# EAGLE design XPDR_Board_1 (EAGLE 7.2.0)
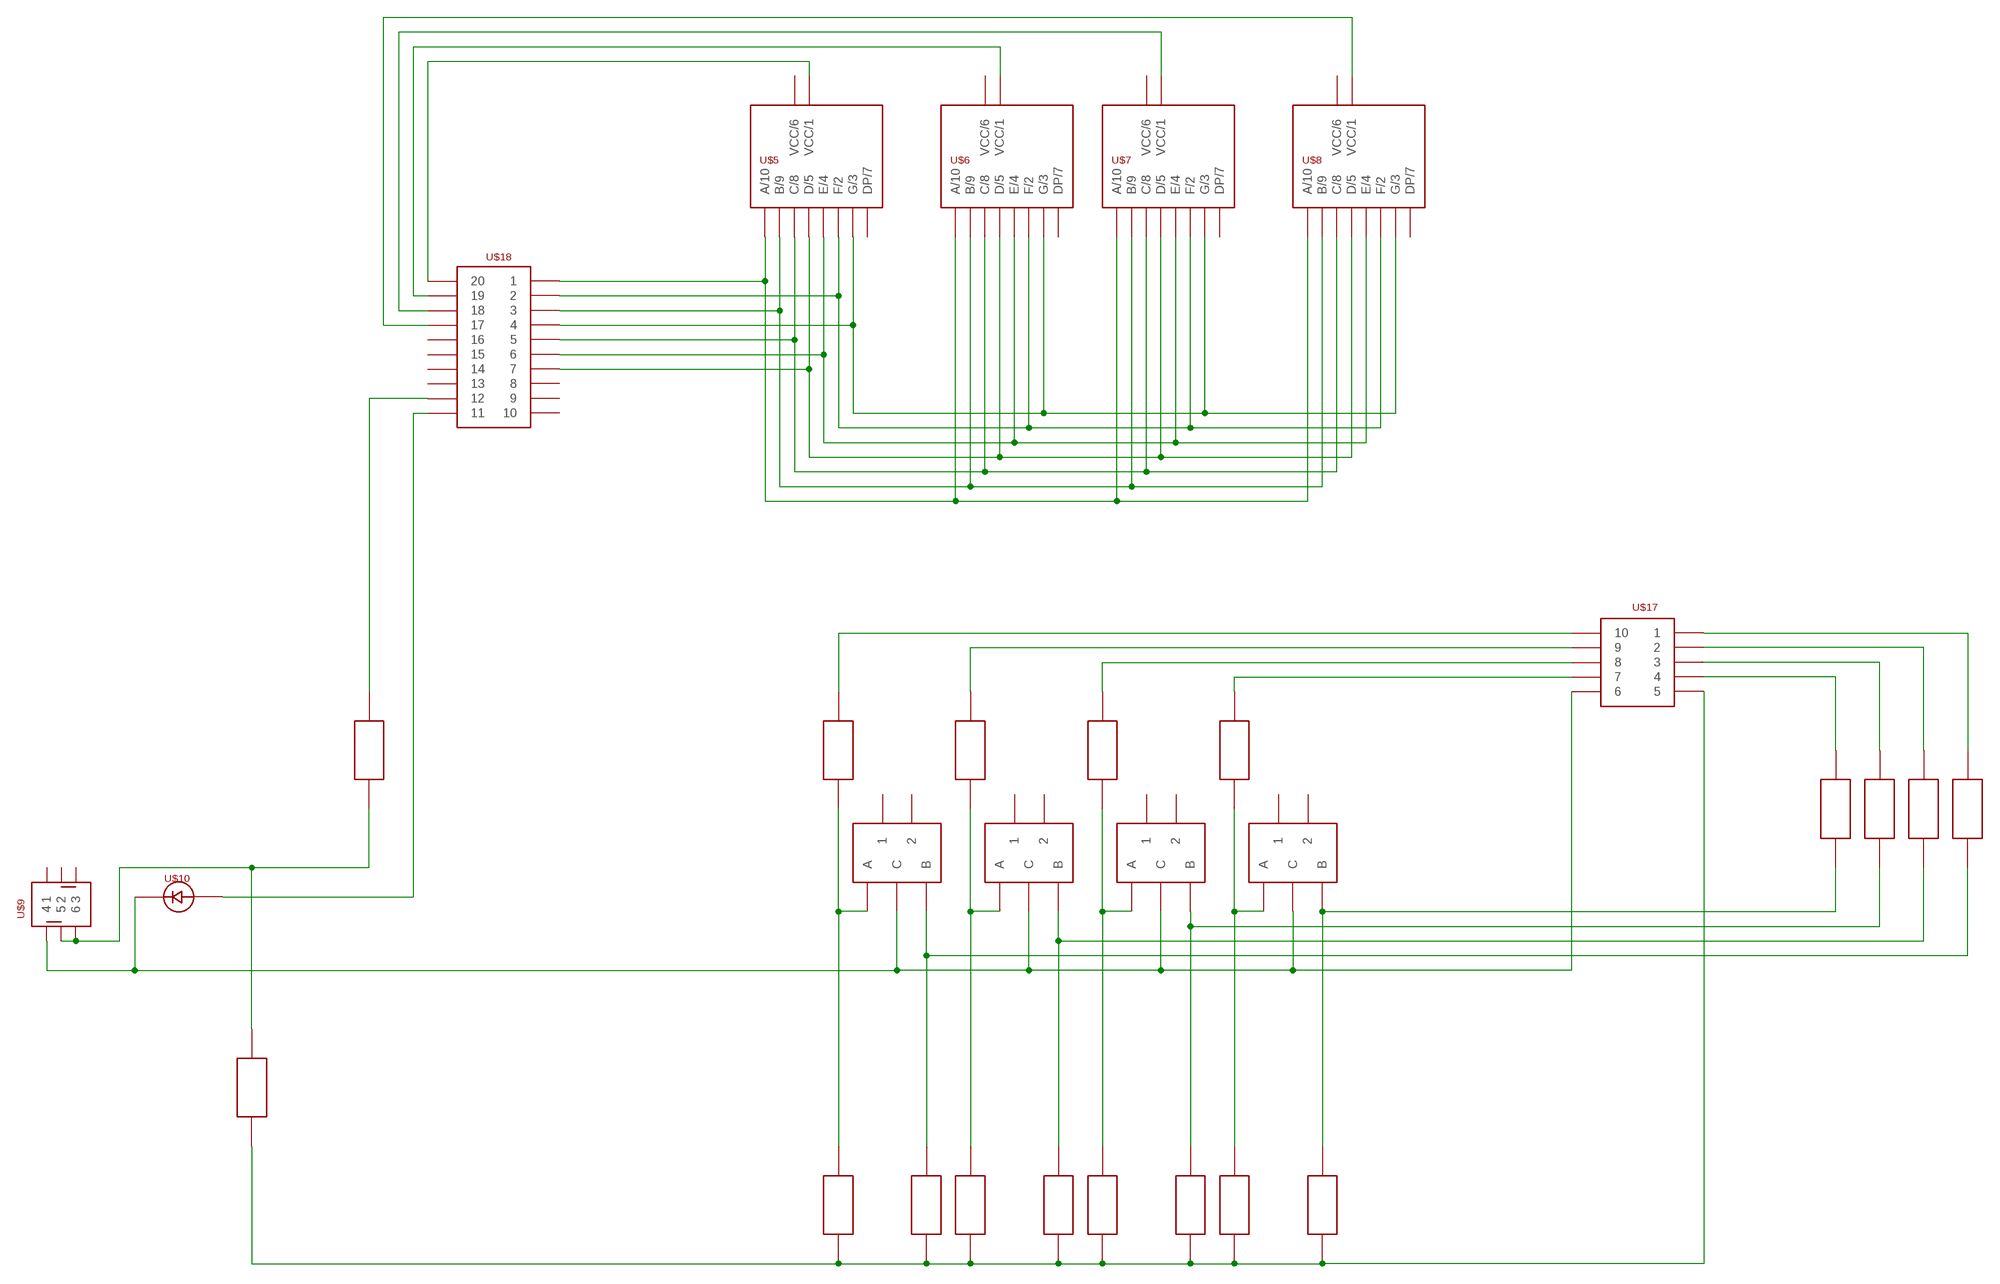
[diagram p0: schematic, sheet 1]

## Parts
U$1  PEC11R  [PEC11R]
U$2  PEC11R  [PEC11R]
U$3  PEC11R  [PEC11R]
U$4  PEC11R  [PEC11R]
U$5  SA3611EWA  [SA3611EWA]
U$6  SA3611EWA  [SA3611EWA]
U$7  SA3611EWA  [SA3611EWA]
U$8  SA3611EWA  [SA3611EWA]
U$9  P1-0S  [P1-0S]
U$10  LED_5MM  [LED_5MM]
U$11  REZISTOR  [REZISTOR]
U$12  REZISTOR  [REZISTOR]
U$13  REZISTOR  [REZISTOR]
U$14  REZISTOR  [REZISTOR]
U$15  REZISTOR  [REZISTOR]
U$16  REZISTOR  [REZISTOR]
U$17  LISTA_2X5  [LISTA_2X5]
U$18  LISTA_2X10  [LISTA_2X10]
U$19  REZISTOR  [REZISTOR]
U$20  REZISTOR  [REZISTOR]
U$21  REZISTOR  [REZISTOR]
U$22  REZISTOR  [REZISTOR]
U$23  REZISTOR  [REZISTOR]
U$24  REZISTOR  [REZISTOR]
U$25  REZISTOR  [REZISTOR]
U$26  REZISTOR  [REZISTOR]
U$27  REZISTOR  [REZISTOR]
U$28  REZISTOR  [REZISTOR]
U$30  REZISTOR  [REZISTOR]
U$31  REZISTOR  [REZISTOR]

## Nets
N$1: U$5.10(A/10) U$6.10(A/10) U$7.10(A/10) U$8.10(A/10) U$18.1
N$2: U$5.9(B/9) U$6.9(B/9) U$7.9(B/9) U$8.9(B/9) U$18.3
N$3: U$5.8(C/8) U$6.8(C/8) U$7.8(C/8) U$8.8(C/8) U$18.5
N$4: U$5.5(D/5) U$6.5(D/5) U$7.5(D/5) U$8.5(D/5) U$18.7
N$5: U$11.P$2 U$17.10
N$6: U$5.2(F/2) U$6.2(F/2) U$7.2(F/2) U$8.2(F/2) U$18.2
N$7: U$5.3(G/3) U$6.3(G/3) U$7.3(G/3) U$8.3(G/3) U$18.4
N$8: U$1.B U$12.P$1 U$27.P$1
N$9: U$5.4(E/4) U$6.4(E/4) U$7.4(E/4) U$8.4(E/4) U$18.6
N$10: U$13.P$2 U$17.9
N$11: U$2.B U$14.P$1 U$25.P$1
N$12: U$15.P$2 U$17.8
N$13: U$3.B U$16.P$1 U$23.P$1
N$14: U$17.7 U$19.P$2
N$15: U$4.B U$20.P$1 U$21.P$1
N$16: U$5.1(VCC/1) U$18.20
N$17: U$6.1(VCC/1) U$18.19
N$18: U$7.1(VCC/1) U$18.18
N$19: U$8.1(VCC/1) U$18.17
N$20: U$9.5 U$9.6 U$30.P$2 U$31.P$1
N$21: U$1.C U$2.C U$3.C U$4.C U$9.4 U$10.P$2 U$17.6
N$22: U$1.A U$11.P$1 U$28.P$1
N$23: U$12.P$2 U$17.1
N$24: U$17.5 U$21.P$2 U$22.P$2 U$23.P$2 U$24.P$2 U$25.P$2 U$26.P$2 U$27.P$2 U$28.P$2 U$31.P$2
N$25: U$3.A U$15.P$1 U$24.P$1
N$26: U$10.P$1 U$18.11
N$27: U$4.A U$19.P$1 U$22.P$1
N$28: U$14.P$2 U$17.2
N$29: U$16.P$2 U$17.3
N$30: U$17.4 U$20.P$2
N$31: U$2.A U$13.P$1 U$26.P$1
N$33: U$18.12 U$30.P$1
Unconnected: U$1.1 U$1.2 U$2.1 U$2.2 U$3.1 U$3.2 U$4.1 U$4.2 U$5.6(VCC/6) U$5.7(DP/7) U$6.6(VCC/6) U$6.7(DP/7) U$7.6(VCC/6) U$7.7(DP/7) U$8.6(VCC/6) U$8.7(DP/7) U$9.1 U$9.2 U$9.3 U$18.8 U$18.9 U$18.10 U$18.13 U$18.14 U$18.15 U$18.16

## Library data of the parts
U$1-U$4 = RadioStack_v2:PEC11R
U$5-U$8 = RadioStack_v2:SA3611EWA
U$9 = RadioStack_v2:P1-0S
U$10 = RadioStack_v2:LED_5MM
U$11-U$16 U$19-U$28 U$30 U$31 = RadioStack_v2:REZISTOR
U$17 = RadioStack_v2:LISTA_2X5
U$18 = RadioStack_v2:LISTA_2X10

## Board
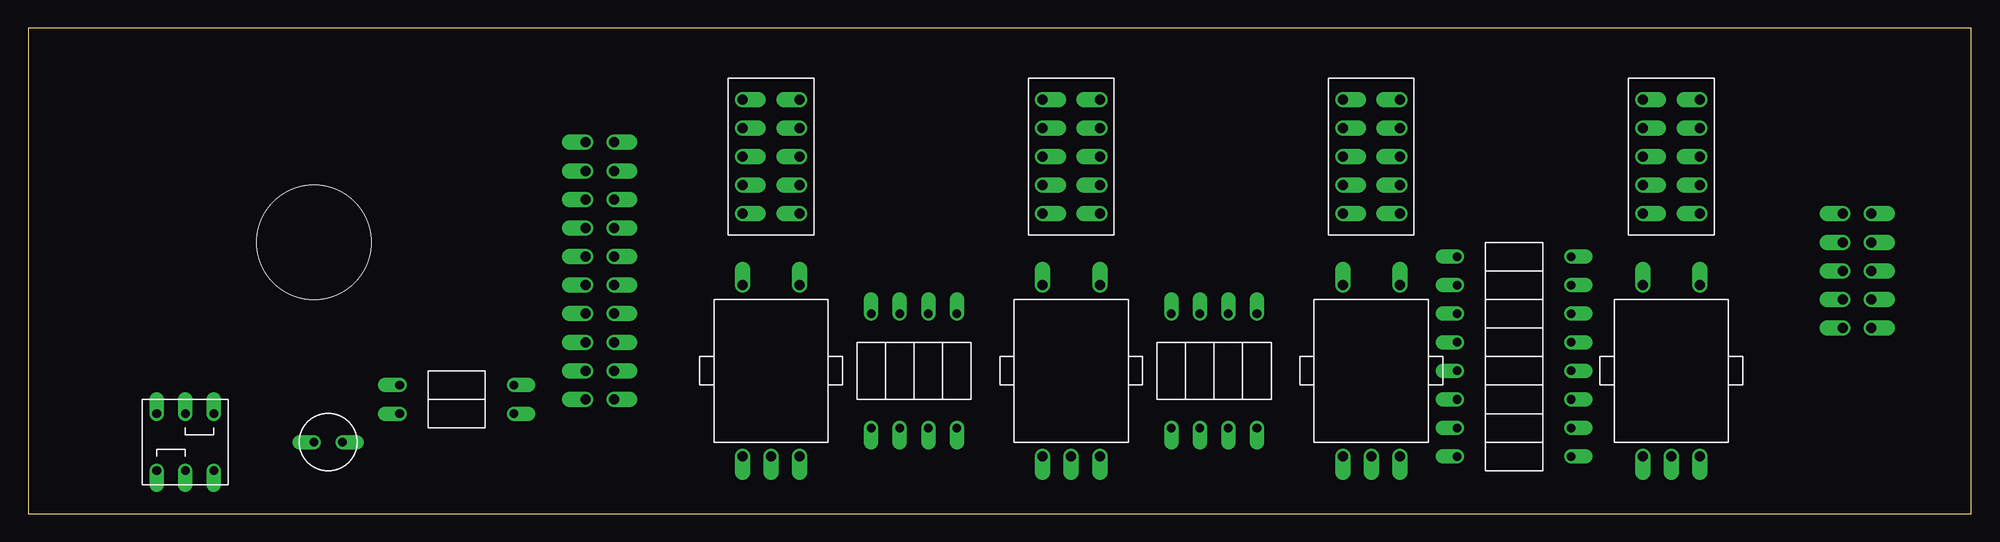
[diagram p1: board, top side]
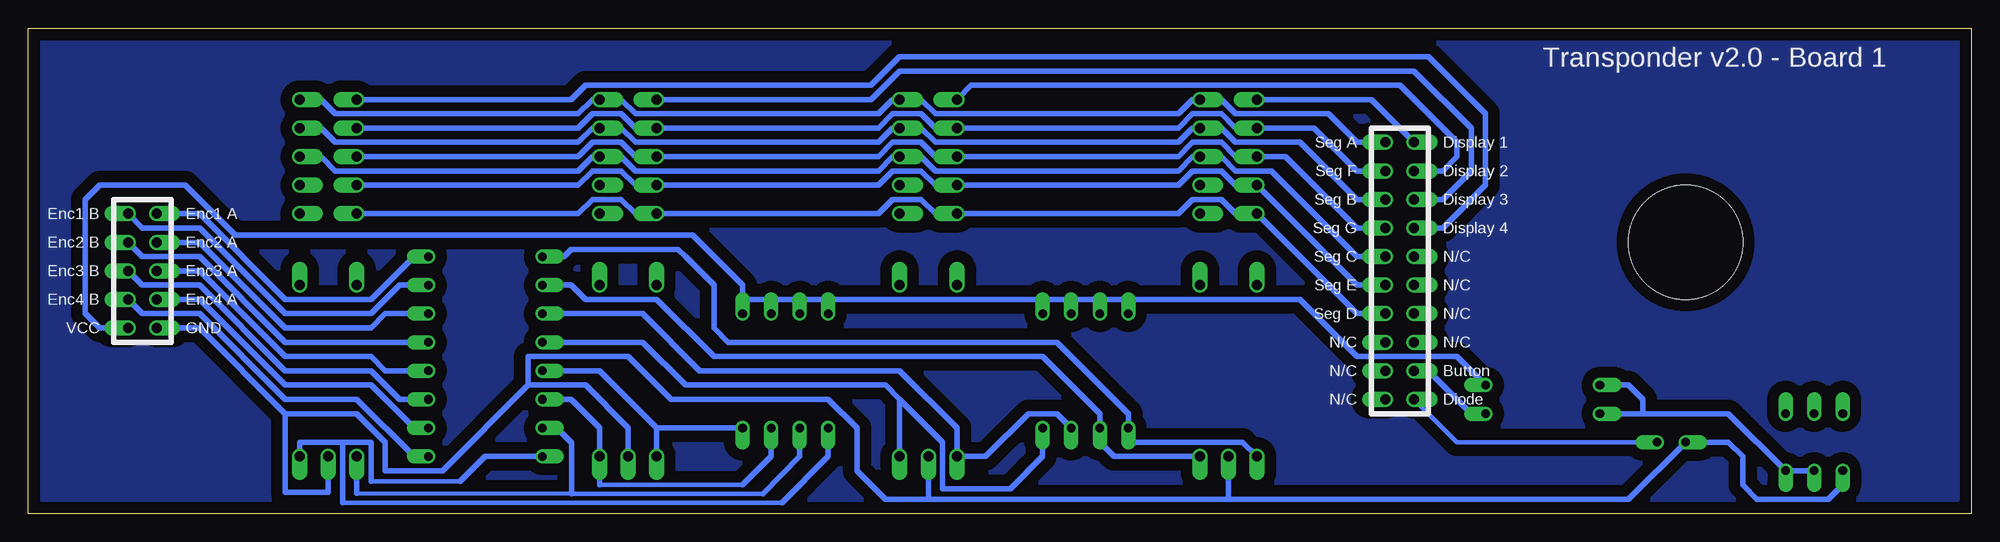
[diagram p2: board, bottom side, seen from below]

Size 172.72 x 43.18 mm. Coordinates in mm from the lower left corner, seen from the top.
Outline: 0,43.18 0,0 172.72,0 172.72,43.18 0,43.18
Copper layers (1*16): Top 0.035mm / dielectric 1.5mm / Bottom 0.035mm
Design rules "RadioStack_v2": minimum track width 0.2mm, minimum drill 0.4mm, track to track 0.2mm, track to pad 0.2mm, pad to pad 0.2mm, via to via 0.2mm, smd to smd 0.2mm, copper to edge 0.5mm, drill to drill 8mil, minimum pad ring 10mil, minimum via ring 8mil, stop-mask expansion 4mil, vias tented up to drill 0mil, thermal gap 10mil
Holes 10.16 mm at 25.4,24.13

### Footprints (pad centres in the part's own frame; a part is rotated, then mirrored left to right if it is on the bottom)
PEC11R = drill 0.889 pad 1.27 offset: 1 0,15.24; 2 5.08,15.24; A 0,0; B 5.08,0; C 2.54,0
SA3611EWA = drill 0.889 pad 1.27 offset: 1 0,0; 2 0,-2.54; 3 0,-5.08; 4 0,-7.62; 5 0,-10.16; 6 5.08,-10.16; 7 5.08,-7.62; 8 5.08,-5.08; 9 5.08,-2.54; 10 5.08,0
P1-0S = drill 0.762 pad 1.27 offset: 1 0,0; 2 2.54,0; 3 5.08,0; 4 0,-5.08; 5 2.54,-5.08; 6 5.08,-5.08
LED_5MM = drill 0.762 pad 1.27 offset: P$1 2.54,0; P$2 0,0
REZISTOR = drill 0.762 pad 1.27 offset: P$1 -5.08,0; P$2 5.08,0
LISTA_2X5 = drill 0.889 pad 1.27 offset: 1 0,0; 2 0,-2.54; 3 0,-5.08; 4 0,-7.62; 5 0,-10.16; 6 2.54,-10.16; 7 2.54,-7.62; 8 2.54,-5.08; 9 2.54,-2.54; 10 2.54,0
LISTA_2X10 = drill 0.889 pad 1.27 offset: 1 0,0; 2 0,-2.54; 3 0,-5.08; 4 0,-7.62; 5 0,-10.16; 6 0,-12.7; 7 0,-15.24; 8 0,-17.78; 9 0,-20.32; 10 0,-22.86; 11 2.54,-22.86; 12 2.54,-20.32; 13 2.54,-17.78; 14 2.54,-15.24; 15 2.54,-12.7; 16 2.54,-10.16; 17 2.54,-7.62; 18 2.54,-5.08; 19 2.54,-2.54; 20 2.54,0

### Placement (x,y rotation side)
U$1  63.5,5.08 0 top
U$2  90.17,5.08 0 top
U$3  116.84,5.08 0 top
U$4  143.51,5.08 0 top
U$5  63.5,36.83 0 top
U$6  90.17,36.83 0 top
U$7  116.84,36.83 0 top
U$8  143.51,36.83 0 top
U$9  11.43,8.89 0 top
U$10  25.4,6.35 0 top
U$11  132.08,22.86 0 top
U$12  132.08,20.32 0 top
U$13  132.08,17.78 0 top
U$14  132.08,15.24 0 top
U$15  132.08,12.7 0 top
U$16  132.08,10.16 0 top
U$17  163.83,26.67 0 bottom
U$18  52.07,33.02 0 bottom
U$19  132.08,7.62 0 top
U$20  132.08,5.08 0 top
U$21  101.6,12.7 90 top
U$22  104.14,12.7 90 top
U$23  106.68,12.7 90 top
U$24  109.22,12.7 90 top
U$25  82.55,12.7 90 top
U$26  80.01,12.7 90 top
U$27  77.47,12.7 90 top
U$28  74.93,12.7 90 top
U$30  38.1,8.89 180 top
U$31  38.1,11.43 0 top

### Tracks (layer width: path | path; a pad name or v marks a point on that pad's centre or on a via)
N$1
  Bottom 0.508: U$8.10 146.69,36.83 145.41,35.56 123.83,35.56 122.56,36.83 U$7.10 120.02,36.83 118.75,35.56 97.16,35.56 95.89,36.83 U$6.10 93.34,36.83 92.08,35.56 70.48,35.56 69.22,36.83 U$5.10 66.67,36.83 65.41,35.56 57.15,35.56 54.61,33.02 U$18.1
N$2
  Bottom 0.508: U$8.9 146.69,34.29 145.41,33.02 123.83,33.02 122.56,34.29 U$7.9 120.02,34.29 118.75,33.02 97.16,33.02 95.89,34.29 U$6.9 93.34,34.29 92.08,33.02 70.48,33.02 69.22,34.29 U$5.9 66.67,34.29 65.41,33.02 59.69,33.02 54.61,27.94 U$18.3
N$3
  Bottom 0.508: U$8.8 146.69,31.75 145.41,30.48 123.83,30.48 122.56,31.75 U$7.8 120.02,31.75 118.75,30.48 97.16,30.48 95.89,31.75 U$6.8 93.34,31.75 92.08,30.48 70.48,30.48 69.22,31.75 U$5.8 66.67,31.75 65.41,30.48 62.23,30.48 54.61,22.86 U$18.5
N$4
  Bottom 0.508: U$8.5 123.83,26.67 122.56,27.94 120.02,27.94 118.75,26.67 U$7.5 97.16,26.67 95.89,27.94 93.34,27.94 92.08,26.67 U$6.5 70.48,26.67 69.22,27.94 66.67,27.94 65.41,26.67 U$5.5 54.61,17.78 U$18.7
N$5
  Bottom 0.508: U$17.10 157.48,26.67 149.86,19.05 142.24,19.05 138.43,22.86 U$11.P$2
N$6
  Bottom 0.508: U$8.2 123.83,34.29 122.56,35.56 120.02,35.56 118.75,34.29 U$7.2 97.16,34.29 95.89,35.56 93.34,35.56 92.08,34.29 U$6.2 70.48,34.29 69.22,35.56 66.67,35.56 65.41,34.29 U$5.2 58.42,34.29 54.61,30.48 U$18.2
N$7
  Bottom 0.508: U$8.3 123.83,31.75 122.56,33.02 120.02,33.02 118.75,31.75 U$7.3 97.16,31.75 95.89,33.02 93.34,33.02 92.08,31.75 U$6.3 70.48,31.75 69.22,33.02 66.67,33.02 65.41,31.75 U$5.3 60.96,31.75 54.61,25.4 U$18.4
N$8
  Bottom 0.508: U$12.P$1 124.46,20.32 123.19,19.05 116.84,19.05 111.76,13.97 82.55,13.97 77.47,8.89 U$27.P$1 77.47,6.35 76.2,5.08 U$1.B
N$9
  Bottom 0.508: U$8.4 123.83,29.21 122.56,30.48 120.02,30.48 118.75,29.21 U$7.4 97.16,29.21 95.89,30.48 93.34,30.48 92.08,29.21 U$6.4 70.48,29.21 69.22,30.48 66.67,30.48 65.41,29.21 U$5.4 54.61,20.32 U$18.6
N$10
  Bottom 0.508: U$17.9 157.48,24.13 149.86,16.51 142.24,16.51 140.97,17.78 U$13.P$2
N$11
  Bottom 0.508: U$14.P$1 118.11,15.24 114.3,11.43 96.52,11.43 95.25,10.16 | U$25.P$1 82.55,5.08 85.41,2.22 91.44,2.22 91.44,6.35 95.25,10.16 | U$2.B 95.25,10.16
N$12
  Bottom 0.508: U$17.8 157.48,21.59 149.86,13.97 142.24,13.97 140.97,12.7 U$15.P$2
N$13
  Bottom 0.406: 109.22,2.54 121.92,2.54
  Bottom 0.508: U$16.P$1 124.46,10.16 121.92,7.62 121.92,6.35 U$3.B 121.92,2.54 | U$23.P$1 106.68,5.08 109.22,2.54
N$14
  Bottom 0.508: U$17.7 157.48,19.05 149.86,11.43 142.24,11.43 138.43,7.62 U$19.P$2
N$15
  Bottom 0.406: 142.24,2.86 134.3,2.86 | 105.73,0.95 144.78,0.95
  Bottom 0.508: U$4.B 148.59,6.35 144.78,6.35 | 144.78,6.35 142.24,6.35 142.24,2.86 | 134.3,2.86 132.08,5.08 U$20.P$1 | U$21.P$1 101.6,5.08 105.73,0.95 | 144.78,0.95 144.78,6.35
N$16
  Bottom 0.508: U$5.1 53.34,36.83 U$18.20
N$17
  Bottom 0.508: U$6.1 88.9,38.1 50.8,38.1 45.72,33.02 45.72,31.75 46.99,30.48 U$18.19
N$18
  Bottom 0.508: U$7.1 97.79,36.83 95.25,39.37 49.53,39.37 44.45,34.29 44.45,30.48 46.99,27.94 U$18.18
N$19
  Bottom 0.508: U$8.1 124.46,36.83 123.19,38.1 97.79,38.1 95.25,40.64 48.26,40.64 43.18,35.56 43.18,29.21 46.99,25.4 U$18.17
N$20
  Bottom 0.508: U$9.5 U$9.6 21.59,8.89 29.21,8.89 | U$30.P$2 29.21,8.89 | U$31.P$1 30.48,11.43 29.21,10.16 29.21,8.89
N$21
  Bottom 0.508: U$2.C 92.71,1.27 | 92.71,1.27 96.52,1.27 99.06,3.81 99.06,7.62 101.6,10.16 115.57,10.16 119.38,13.97 128.27,13.97 128.27,11.43 | U$1.C 66.04,1.27 | 66.04,1.27 92.71,1.27 | U$9.4 11.43,2.54 12.7,1.27 19.05,1.27 20.32,2.54 20.32,5.08 21.59,6.35 U$10.P$2 30.48,1.27 66.04,1.27 | 149.86,8.89 157.48,16.51 U$17.6 | 149.86,8.89 149.86,1.91 146.05,1.91 U$4.C | U$3.C 119.38,7.62 123.19,11.43 128.27,11.43 | 128.27,11.43 135.89,3.81 140.97,3.81 140.97,6.35 143.51,8.89 149.86,8.89
N$22
  Bottom 0.508: U$1.A 64.77,6.35 74.93,6.35 U$28.P$1 74.93,8.89 81.28,15.24 110.49,15.24 111.76,16.51 111.76,20.32 114.3,22.86 114.94,23.5 124.46,23.5 125.09,22.86 U$11.P$1
N$23
  Bottom 0.508: U$12.P$2 139.7,20.32 142.24,17.78 149.86,17.78 157.48,25.4 162.56,25.4 U$17.1
N$24
  Bottom 0.508: U$17.5 166.37,16.51 167.64,17.78 167.64,27.94 166.37,29.21 158.75,29.21 154.31,24.77 113.67,24.77 109.22,20.32 109.22,19.05 | U$31.P$2 45.72,13.97 54.61,13.97 59.69,19.05 74.93,19.05 | 77.47,19.05 74.93,19.05 | 74.93,19.05 U$28.P$2 | U$27.P$2 77.47,19.05 | 77.47,19.05 80.01,19.05 | U$26.P$2 80.01,19.05 | 80.01,19.05 82.55,19.05 | 82.55,19.05 U$25.P$2 | 109.22,19.05 U$24.P$2 | 106.68,19.05 109.22,19.05 | U$23.P$2 106.68,19.05 | 106.68,19.05 104.14,19.05 | U$22.P$2 104.14,19.05 | 104.14,19.05 101.6,19.05 | U$21.P$2 101.6,19.05 | 101.6,19.05 82.55,19.05
N$25
  Bottom 0.508: U$15.P$1 121.92,12.7 116.84,7.62 | U$24.P$1 116.84,7.62 | 116.84,7.62 U$3.A
N$26
  Bottom 0.406: U$10.P$1 45.72,6.35 U$18.11
N$27
  Bottom 0.406: 143.51,1.8 124.4,1.78 107.4,1.78
  Bottom 0.508: U$4.A 143.51,1.8 | 124.4,1.78 124.4,6.28 125.73,7.62 U$19.P$1 | U$22.P$1 104.14,5.08 107.4,1.78
N$28
  Bottom 0.508: U$14.P$2 149.86,15.24 157.48,22.86 162.56,22.86 U$17.2
N$29
  Bottom 0.508: U$16.P$2 139.7,10.16 142.24,12.7 149.86,12.7 157.48,20.32 162.56,20.32 U$17.3
N$30
  Bottom 0.508: U$20.P$2 138.43,5.08 143.51,10.16 149.86,10.16 157.48,17.78 162.56,17.78 U$17.4
N$31
  Bottom 0.508: U$13.P$1 118.11,17.78 113.03,12.7 95.25,12.7 90.17,7.62 U$2.A 87.63,5.08 83.82,8.89 81.28,8.89 U$26.P$1
N$33
  Bottom 0.508: U$18.12 48.26,12.7 44.45,8.89 U$30.P$1
N$34
  pour Bottom (isolate 1.016): 1.27,41.91 171.45,41.91 171.45,1.27 1.27,1.27

### Text on the board
bPlace: Transponder v2.0 - Board 1 | Display 1 | Seg A | Display 2 | Seg F | Display 3 | Seg B | Enc1 A | Enc1 B | Display 4 | Seg G | Enc2 A | Enc2 B | N/C | Seg C | Enc3 A | Enc3 B | N/C | Seg E | Enc4 A | Enc4 B | N/C | Seg D | GND | VCC | N/C | N/C | Button | N/C | Diode | N/C